# EasyEDA schematic SCH_MUSICA.json
TITLE: MUSICA; REV: 1.0; Date: 2024-05-06; Sheet: 1/1; Drawn By: notaroomba; Company: Code Composers
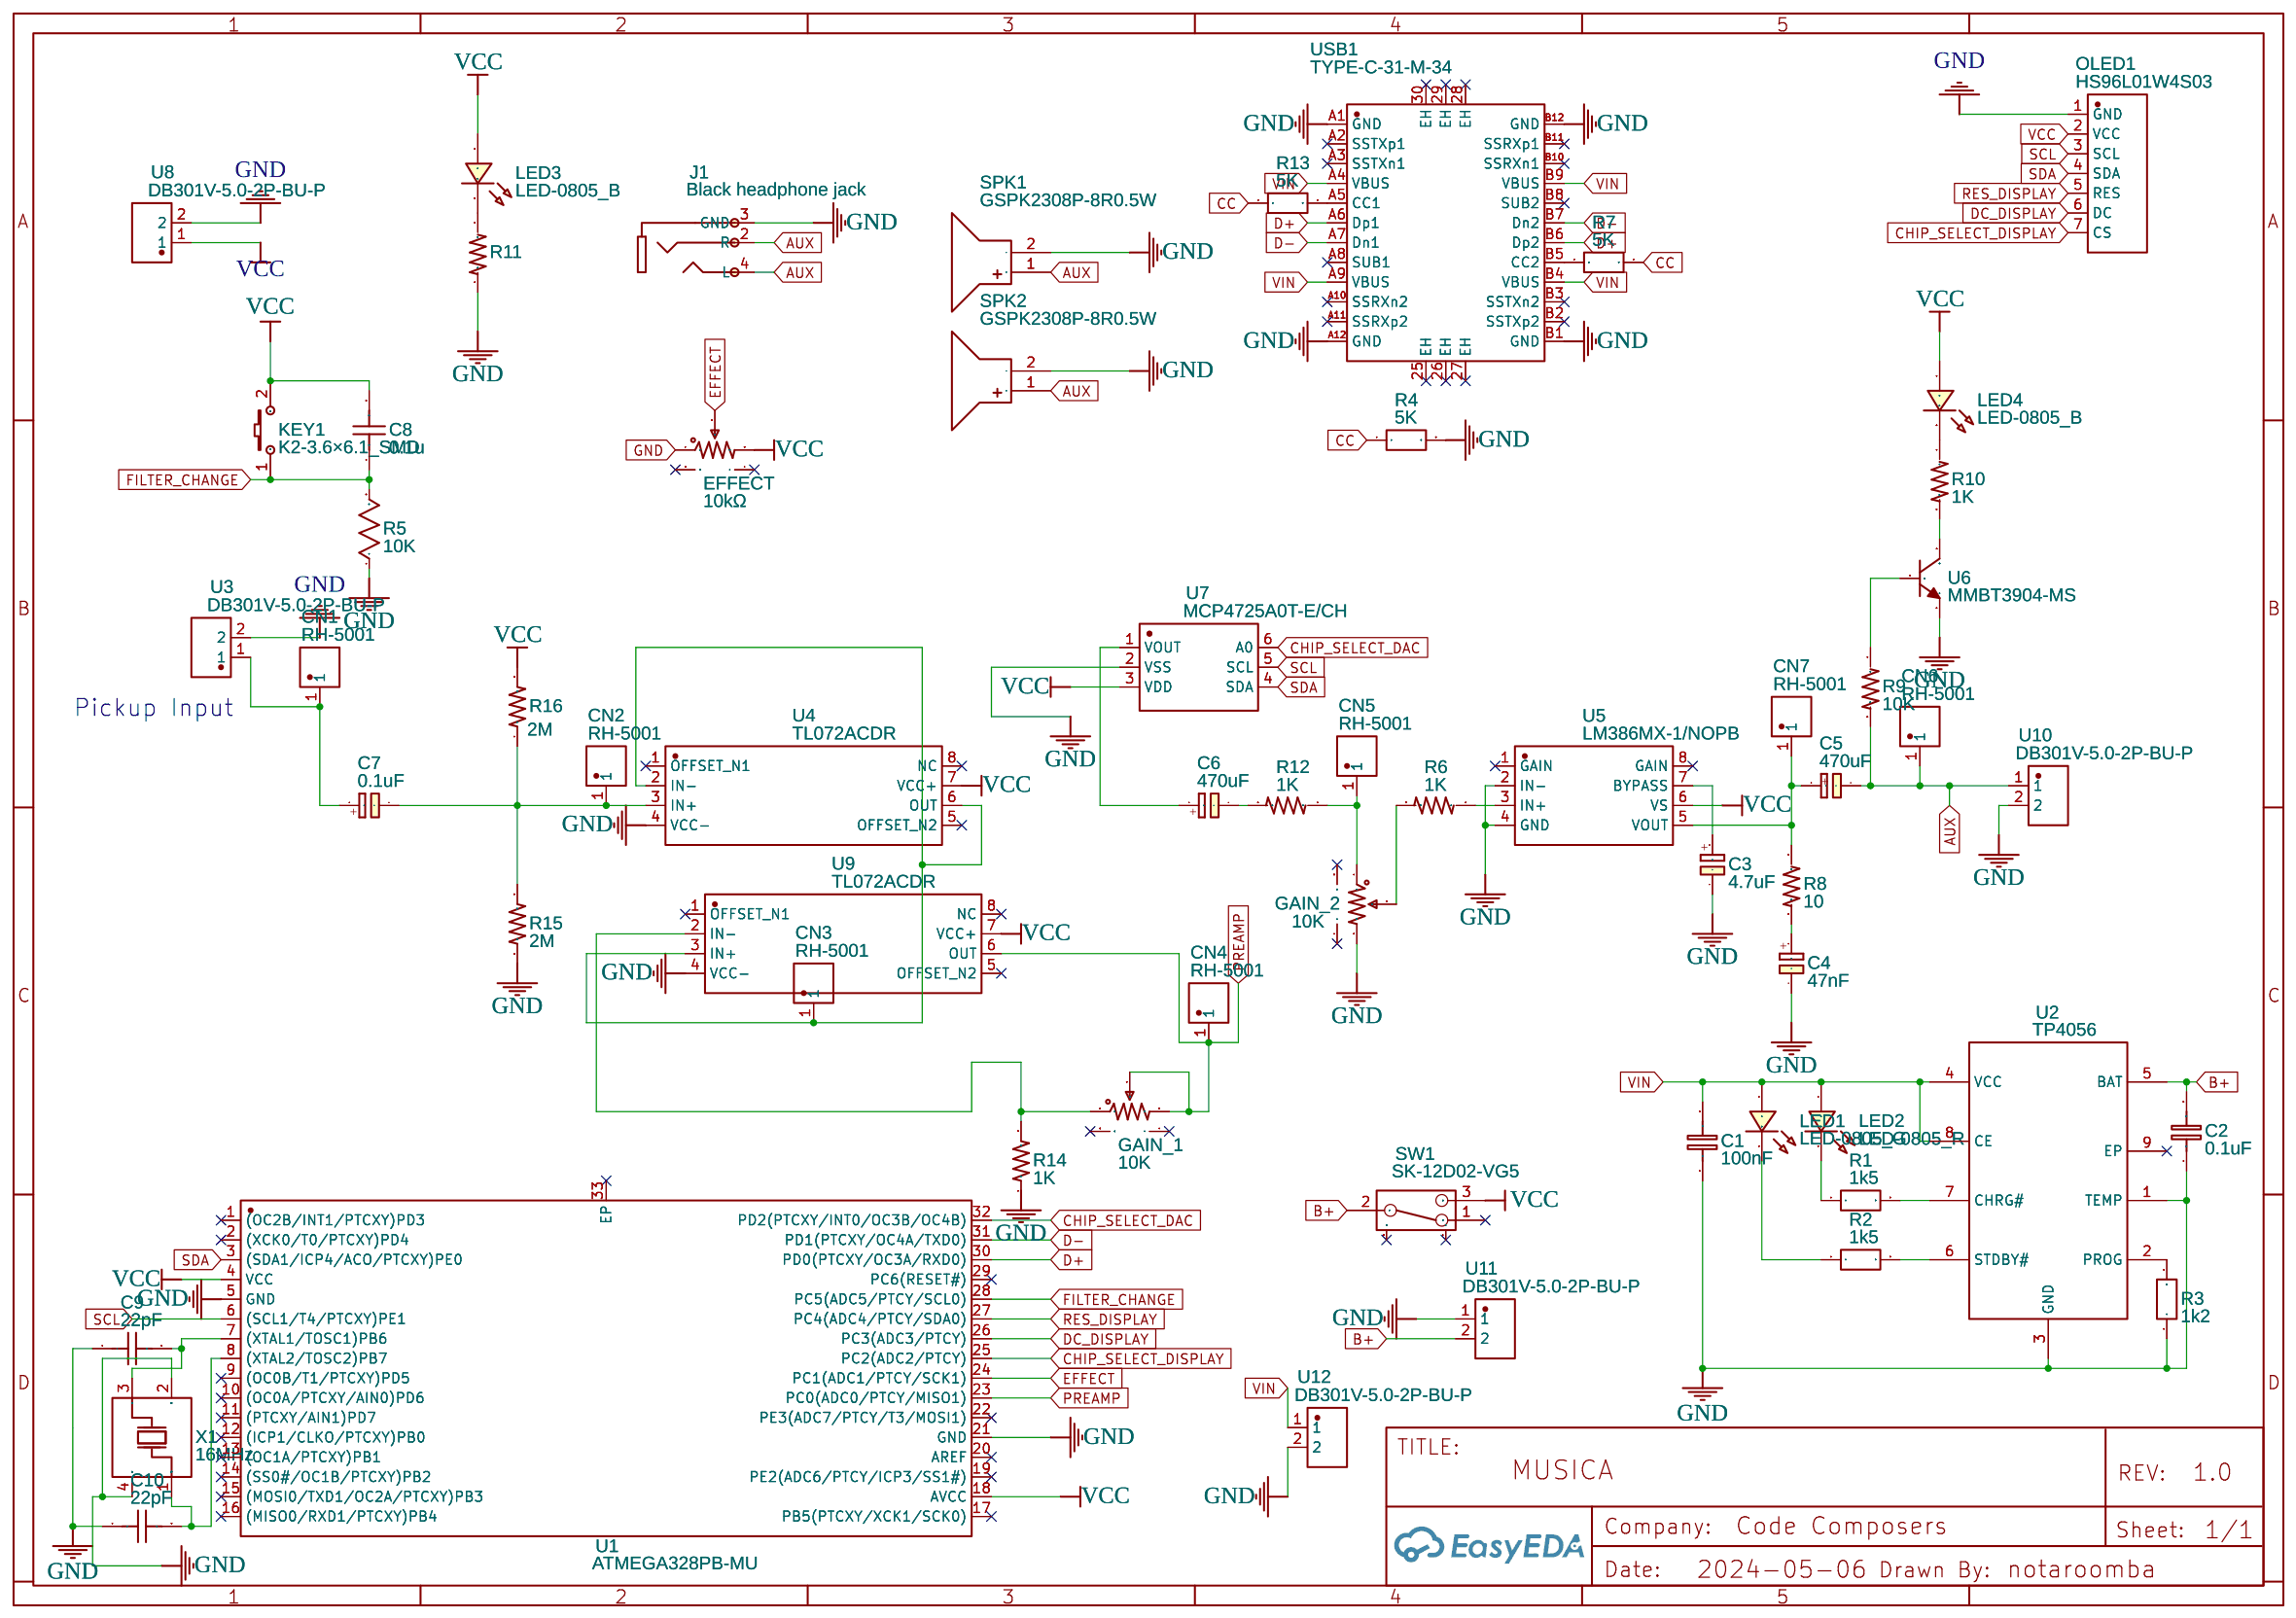
[diagram p0: schematic sheet]

## Parts
C1  100nF  [C0603]
C2  0.1uF  [C0603]
C3  4.7uF  [PR-CAPACITOR-POL-S]
C4  47nF  [PR-CAPACITOR-POL-S]
C5  470uF  [PR-CAPACITOR-POL-S]
C6  470uF  [PR-CAPACITOR-POL-S]
C7  0.1uF  [PR-CAPACITOR-POL-S]
C8  0.1u  [C0603]
C9  22pF  [C0603]
C10  22pF  [C0603]
CN1  RH-5001  [TESTPOINT-TH_BD3.2-D1.6-1]
CN2  RH-5001  [TESTPOINT-TH_BD3.2-D1.6-1]
CN3  RH-5001  [TESTPOINT-TH_BD3.2-D1.6-1]
CN4  RH-5001  [TESTPOINT-TH_BD3.2-D1.6-1]
CN5  RH-5001  [TESTPOINT-TH_BD3.2-D1.6-1]
CN6  RH-5001  [TESTPOINT-TH_BD3.2-D1.6-1]
CN7  RH-5001  [TESTPOINT-TH_BD3.2-D1.6-1]
EFFECT  10kΩ  [RES-ADJ-TH_RK09L1140A5P]
GAIN_1  10K  [RES-ADJ-TH_RK09L1140A5P]
GAIN_2  10K  [RES-ADJ-TH_RK09L1140A5P]
J1  Black headphone jack  [AUDIO-TH_PJ-3200]
KEY1  K2-3.6×6.1_SMD  [KEY-SMD_2P-L6.2-W3.6-LS8.0]
LED1  LED-0805_G  [LED0805_GREEN]
LED2  LED-0805_R  [LED0805_RED]
LED3  LED-0805_B  [LED0805_BLUE]
LED4  LED-0805_B  [LED0805_BLUE]
OLED1  HS96L01W4S03  [OLED-TH_HS96L01W4S03]
R1  1k5  [R0603]
R2  1k5  [R0603]
R3  1k2  [R0603]
R4  5K  [R0603]
R5  10K  [R0603]
R6  1K  [0805]
R7  5K  [R0603]
R8  10  [0805]
R9  10K  [0805]
R10  1K  [0805]
R11  1K  [0805]
R12  1K  [0805]
R13  5K  [R0603]
R14  1K  [0805]
R15  2M  [0805]
R16  2M  [0805]
SPK1  GSPK2308P-8R0.5W  [SPK-TH_BD23.0-P10.00-D0.8-L-RD]
SPK2  GSPK2308P-8R0.5W  [SPK-TH_BD23.0-P10.00-D0.8-L-RD]
SW1  SK-12D02-VG5  [SW-TH_SK-12D02VG3]
U1  ATMEGA328PB-MU  [QFN-32_L5.0-W5.0-P0.50-TL-EP3.1]
U2  TP4056  [ESOP-8_L4.9-W3.9-P1.27-LS6.0-BL-EP]
U3  DB301V-5.0-2P-BU-P  [CONN-TH_2P-P5.00_DB301V-5.0-2P-BU-P]
U4  TL072ACDR  [SOIC-8_L4.9-W3.9-P1.27-LS6.0-BL]
U5  LM386MX-1/NOPB  [SOIC-8_L4.9-W3.9-P1.27-LS6.0-BL]
U6  MMBT3904-MS  [SOT-23_L2.9-W1.3-P1.90-LS2.4-BR]
U7  MCP4725A0T-E/CH  [SOT-23-6_L2.9-W1.6-P0.95-LS2.8-BL]
U8  DB301V-5.0-2P-BU-P  [CONN-TH_2P-P5.00_DB301V-5.0-2P-BU-P]
U9  TL072ACDR  [SOIC-8_L4.9-W3.9-P1.27-LS6.0-BL]
U10  DB301V-5.0-2P-BU-P  [CONN-TH_2P-P5.00_DB301V-5.0-2P-BU-P]
U11  DB301V-5.0-2P-BU-P  [CONN-TH_2P-P5.00_DB301V-5.0-2P-BU-P]
U12  DB301V-5.0-2P-BU-P  [CONN-TH_2P-P5.00_DB301V-5.0-2P-BU-P]
USB1  TYPE-C-31-M-34  [USB-C-TH_TYPE-C-31-M-43]
X1  16MHz  [OSC-SMD_4P-L3.2-W2.5-BL]

## Library data of the parts
C1 C2 = C_0603_EU: Contributor: LCEDA_Lib
C3-C7 = CAPACITOR_POL_S: Contributor: DangerousPrototype
C8-C10 = C_0603_US: Contributor: LCEDA_Lib
CN1-CN7 = RH-5001: Supplier: LCSC; Supplier Part: C5199801; Manufacturer: 荣和; JLCPCB Part Class: Extended Part; Contributor: lcsc
EFFECT GAIN_1 GAIN_2 = RK09L114001T: Supplier: LCSC; Supplier Part: C470463; Manufacturer: ALPSALPINE(阿尔卑斯阿尔派); JLCPCB Part Class: Extended Part
J1 = Black headphone jack: Supplier: LCSC; Manufacturer: BOOMELE(博穆精密); Manufacturer Part: 320B直插; Supplier Part: C18166; JLCPCB Part Class: Extended Part
KEY1 = K2-3.6×6.1_SMD: Supplier Part: C118141; Supplier: LCSC; Manufacturer Part: K2-1107ST-A4SW-06; Contributor: LCEDA_Lib; 制造商: 韩国韩荣
LED1 = LED-0805_G: Manufacturer: 国星光电; Manufacturer Part: NCD0805G1; Supplier Part: C84260; Contributor: LCEDA_Lib
LED2 = LED-0805_R: Manufacturer: EVERLIGHT(台湾亿光); Manufacturer Part: 17-21SURC/S530-A3/TR8; Supplier Part: C72037; Contributor: LCEDA_Lib
LED3 LED4 = LED-0805_B: Manufacturer: 方舟 ARKLED; Manufacturer Part: D-B080508B1-KS2; Supplier Part: C108412; Contributor: LCEDA_Lib
OLED1 = HS96L01W4S03: Supplier: LCSC; Supplier Part: C5139758; Manufacturer: HS(汉昇); JLCPCB Part Class: Extended Part; Contributor: lcsc
R1-R4 R7 R13 = R_0603_EU: Contributor: LCEDA_Lib
R5 = R_0603_US: Contributor: LCEDA_Lib
R6 R8-R12 R14-R16 = RESISTOR0805-RES: Contributor: johhngalt
SPK1 SPK2 = GSPK2308P-8R0.5W: Contributor: LCSC; Supplier: LCSC; Supplier Part: C530532; Manufacturer: INGHAi(赢海); JLCPCB Part Class: Extended Part
SW1 = SK-12D02-VG5: Supplier: LCSC; Supplier Part: C136722; Manufacturer: Rectangular Connectors - Contacts; Contributor: LCSC
U1 = ATMEGA328PB-MU: Contributor: LCSC; Supplier: LCSC; Supplier Part: C967933; Manufacturer: MICROCHIP(美国微芯); JLCPCB Part Class: Extended Part
U2 = TP4056: Contributor: Guest; Supplier: LCSC; Manufacturer: TOPPOWER(南京拓微); Manufacturer Part: TP4056-42-ESOP8; Supplier Part: C16581; JLCPCB Part Class: Extended Part
U3 U8 U10-U12 = DB301V-5.0-2P-BU-P: Contributor: LCSC; Supplier: LCSC; Supplier Part: C430621; Manufacturer: DORABO(地博电气); JLCPCB Part Class: Extended Part
U4 U9 = TL072ACDR: Contributor: LCSC; Supplier: LCSC; Manufacturer: TI(德州仪器); Supplier Part: C163525; JLCPCB Part Class: Extended Part
U5 = LM386MX-1/NOPB: Supplier: LCSC; Manufacturer: TI(德州仪器); Supplier Part: C23573; JLCPCB Part Class: Extended Part
U6 = MMBT3904-MS: Contributor: lcsc; Supplier: LCSC; Supplier Part: C5120740; Manufacturer: MSKSEMI(美森科); JLCPCB Part Class: Extended Part
U7 = MCP4725A0T-E/CH: Contributor: LCSC; Supplier: LCSC; Manufacturer: MICROCHIP(美国微芯); Supplier Part: C144198; JLCPCB Part Class: Extended Part
USB1 = TYPE-C-31-M-34: Contributor: LCSC; Supplier: LCSC; Supplier Part: C2909199; Manufacturer: 韩国韩荣; JLCPCB Part Class: Extended Part
X1 = X322516MLB4SI: Supplier: LCSC; Manufacturer: YXC(扬兴晶振); Supplier Part: C13738; JLCPCB Part Class: Basic Part

## Nets
GND: C1.1 C2.1 C3.- C4.- C9.1 C10.1 EFFECT.1 GAIN_2.3 J1.3(GND) OLED1.1(GND) R3.1 R4.2 R5.1 R11.2 R14.1 R15.1 SPK1.2(-) SPK2.2(-) U1.5(GND) U1.21(GND) U2.1(TEMP) U2.3(GND) U3.2 U4.4(VCC-) U5.2(IN-) U5.4(GND) U6.2(E) U7.2(VSS) U8.2 U9.4(VCC-) U10.2 U11.1 U12.2 USB1.A1(GND) USB1.A12(GND) USB1.B1(GND) USB1.B12(GND) X1.2(GND) X1.4(GND)
VCC: C8.2 EFFECT.3 KEY1.2 LED3.1 LED4.1 OLED1.2(VCC) R16.2 SW1.3 U1.4(VCC) U1.18(AVCC) U4.7(VCC+) U5.6(VS) U7.3(VDD) U8.1 U9.7(VCC+)
VIN: C1.2 LED1.1 LED2.1 U2.4(VCC) U2.8(CE) U12.1 USB1.A4(VBUS) USB1.A9(VBUS) USB1.B4(VBUS) USB1.B9(VBUS)
AUX: C5.- CN6.1 J1.2(R) J1.4(L) R9.2 SPK1.1(+) SPK2.1(+) U10.1
B+: C2.2 SW1.2 U2.5(BAT) U11.2
CC: R4.1 R7.2 R13.1
CHIP_SELECT_DAC: U1.32(PD2(PTCXY/INT0/OC3B/OC4B)) U7.6(A0)
CHIP_SELECT_DISPLAY: OLED1.7(CS) U1.25(PC2(ADC2/PTCY))
D+: U1.30(PD0(PTCXY/OC3A/RXD0)) USB1.A6(Dp1) USB1.B6(Dp2)
D-: U1.31(PD1(PTCXY/OC4A/TXD0)) USB1.A7(Dn1) USB1.B7(Dn2)
DC_DISPLAY: OLED1.6(DC) U1.26(PC3(ADC3/PTCY))
EFFECT: EFFECT.2 U1.24(PC1(ADC1/PTCY/SCK1))
FILTER_CHANGE: C8.1 KEY1.1 R5.2 U1.28(PC5(ADC5/PTCY/SCL0))
PREAMP: CN4.1 GAIN_1.2 GAIN_1.3 U1.23(PC0(ADC0/PTCY/MISO1)) U9.6(OUT)
RES_DISPLAY: OLED1.5(RES) U1.27(PC4(ADC4/PTCY/SDA0))
SCL: OLED1.3(SCL) U1.6((SCL1/T4/PTCXY)PE1) U7.5(SCL)
SDA: OLED1.4(SDA) U1.3((SDA1/ICP4/ACO/PTCXY)PE0) U7.4(SDA)
Net-(C3-+): C3.+ U5.7(BYPASS)
Net-(C4-+): C4.+ R8.2
Net-(C5-+): C5.+ CN7.1 R8.1 U5.5(VOUT)
Net-(C6-+): C6.+ U7.1(VOUT)
Net-(C6--): C6.- R12.2
Net-(C7-+): C7.+ CN1.1 U3.1
Net-(C7--): C7.- CN2.1 R15.2 R16.1 U4.3(IN+)
Net-(C9-2): C9.2 U1.7((XTAL1/TOSC1)PB6) X1.3(OSC2)
Net-(C10-2): C10.2 U1.8((XTAL2/TOSC2)PB7) X1.1(OSC1)
Net-(CN3-1): CN3.1 U4.2(IN-) U4.6(OUT) U9.3(IN+)
Net-(CN5-1): CN5.1 GAIN_2.1 R12.1
Net-(GAIN_1-1): GAIN_1.1 R14.2 U9.2(IN-)
Net-(GAIN_2-2): GAIN_2.2 R6.2
Net-(LED1-2): LED1.2 R2.1
Net-(LED2-2): LED2.2 R1.1
Net-(LED3-2): LED3.2 R11.1
Net-(LED4-2): LED4.2 R10.1
Net-(R1-2): R1.2 U2.7(CHRG#)
Net-(R2-2): R2.2 U2.6(STDBY#)
Net-(R3-2): R3.2 U2.2(PROG)
Net-(R6-1): R6.1 U5.3(IN+)
Net-(R7-1): R7.1 USB1.B5(CC2)
Net-(R9-1): R9.1 U6.1(B)
Net-(R10-2): R10.2 U6.3(C)
Net-(R13-2): R13.2 USB1.A5(CC1)

Not connected (* = marked no-connect by the designer): EFFECT 4* 5*; GAIN_1 4* 5*; GAIN_2 4* 5*; SW1 1* 4* 5*; U1 1((OC2B/INT1/PTCXY)PD3)* 2((XCK0/T0/PTCXY)PD4)* 9((OC0B/T1/PTCXY)PD5)* 10((OC0A/PTCXY/AIN0)PD6)* 11((PTCXY/AIN1)PD7)* 12((ICP1/CLKO/PTCXY)PB0)* 13((OC1A/PTCXY)PB1)* 14((SS0#/OC1B/PTCXY)PB2)* 15((MOSI0/TXD1/OC2A/PTCXY)PB3)* 16((MISO0/RXD1/PTCXY)PB4)* 17(PB5(PTCXY/XCK1/SCK0))* 19(PE2(ADC6/PTCY/ICP3/SS1#))* 20(AREF)* 22(PE3(ADC7/PTCY/T3/MOSI1))* 29(PC6(RESET#))* 33(EP)*; U2 9(EP)*; U4 1(OFFSET N1)* 5(OFFSET N2)* 8(NC)*; U5 1(GAIN)* 8(GAIN)*; U9 1(OFFSET N1)* 5(OFFSET N2)* 8(NC)*; USB1 25(EH)* 26(EH)* 27(EH)* 28(EH)* 29(EH)* 30(EH)* A2(SSTXp1)* A3(SSTXn1)* A8(SUB1)* A10(SSRXn2)* A11(SSRXp2)* B2(SSTXp2)* B3(SSTXn2)* B8(SUB2)* B10(SSRXn1)* B11(SSRXp1)*

## Notes on the sheet
- Pickup Input
